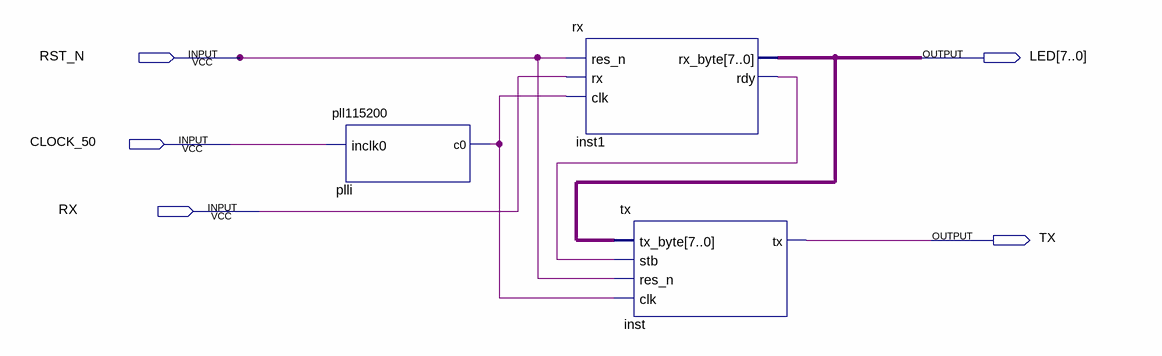
[diagram p0: schematic sheet]
// Quartus schematic toplevel.bdf as structural Verilog: 3 symbols, 5 pins
module toplevel (
  input  RST_N,
  input  CLOCK_50,
  input  RX,
  output [7:0] LED,
  output TX
);

  wire inst1_rdy, plli_c0;

  pll115200 plli (.inclk0(CLOCK_50), .c0(plli_c0));
  rx inst1 (.res_n(RST_N), .rx(RX), .clk(plli_c0), .rx_byte(LED), .rdy(inst1_rdy));
  tx inst (.tx_byte(LED), .stb(inst1_rdy), .res_n(RST_N), .clk(plli_c0), .tx(TX));
endmodule
